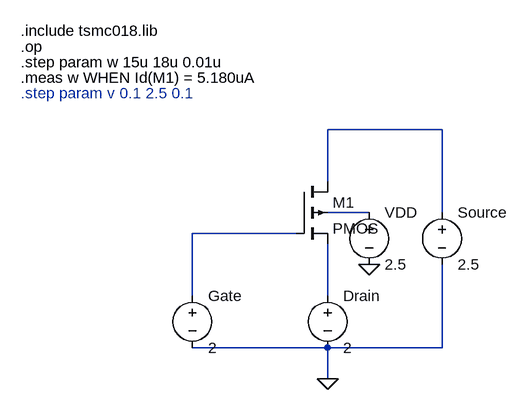
[diagram p0: schematic pmosAspRat.asc]
pmosAspRat.asc, the LTspice schematic file:
Version 4
SHEET 1 880 708
WIRE 512 304 336 304
WIRE 336 384 336 304
WIRE 400 432 336 432
WIRE 512 432 512 304
WIRE 288 464 128 464
WIRE 128 560 128 464
WIRE 336 560 336 480
WIRE 336 640 128 640
WIRE 512 640 512 512
WIRE 512 640 336 640
WIRE 336 688 336 640
FLAG 336 688 0
FLAG 400 512 0
SYMBOL cmosp 288 384 R0
SYMATTR InstName M1
SYMATTR Value2 l=0.35u w={w}
SYMATTR Value PMOS
SYMBOL voltage 512 416 R0
WINDOW 123 0 0 Left 0
WINDOW 39 0 0 Left 0
SYMATTR InstName Source
SYMATTR Value 2.5
SYMBOL voltage 336 544 R0
WINDOW 123 0 0 Left 0
WINDOW 39 0 0 Left 0
SYMATTR InstName Drain
SYMATTR Value 2
SYMBOL voltage 128 544 R0
WINDOW 123 0 0 Left 0
WINDOW 39 0 0 Left 0
SYMATTR InstName Gate
SYMATTR Value 2
SYMBOL voltage 400 416 R0
WINDOW 123 0 0 Left 0
WINDOW 39 0 0 Left 0
SYMATTR InstName VDD
SYMATTR Value 2.5
TEXT -136 152 Left 2 !.include tsmc018.lib
TEXT -136 176 Left 2 !.op
TEXT -136 200 Left 2 !.step param w 15u 18u 0.01u
TEXT -136 224 Left 2 !.meas w WHEN Id(M1) = 5.180uA
TEXT -136 248 Left 2 ;.step param v 0.1 2.5 0.1

The netlist it stands for:
* pmosAspRat.asc
M1 N001 N003 N004 N002 PMOS l=0.35u w={w}
V§Source N001 0 2.5
V§Drain N004 0 2
V§Gate N003 0 2
VDD N002 0 2.5
.model NMOS NMOS
.model PMOS PMOS
.lib standard.mos
.include tsmc018.lib
.op
.step param w 15u 18u 0.01u
.meas w WHEN Id(M1) = 5.180uA
* .step param v 0.1 2.5 0.1
.backanno
.end